# EAGLE design candle (EAGLE 8.3.1)
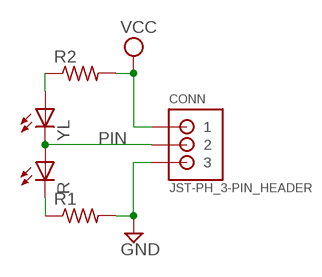
[diagram p0: schematic, sheet 1]

## Parts
CONN  JST-PH_3-PIN_HEADER  [JST_B3B-PH_HEADER]
R  LED3MM  [LED3MM]
R1  R-US_M1206  [M1206]
R2  R-US_M1206  [M1206]
YL  LED3MM  [LED3MM]

## Nets
GND: CONN.P3 R1.2
N$2: R2.1 YL.A
N$3: R1.1 R.K(C)
PIN: CONN.P2 R.A YL.K(C)
VCC: CONN.P1 R2.2

## Library data of the parts
CONN = srg:JST-PH_3-PIN_HEADER: 3-pin JST PH Shrouded Header, top entry P/N B3B-PH-K-S Mating connector PHR-3
R YL = led:LED: LED OSRAM: - CHIPLED LG R971, LG N971, LY N971, LG Q971, LY Q971, LO R971, LY R971 LH N974, LH R974 LS Q976, LO Q976, LY Q976 LO Q996 - Hyper CHIPLED LW Q18S LB Q993, LB Q99A, LB R99A - SideLED LS A670, LO A670, LY A670, LG A670, LP A670 LB A673, LV A673, LT A673, LW A673 LH A674 LY A675 LS A676, LA A676, LO A676, LY A676, LW A676 LS A679, LY A679, LG A679 - Hyper Micro SIDELED® LS Y876, LA Y876, LO Y876, LY Y876 LT Y87S - SmartLED LW L88C, LW L88S LB L89C, LB L89S, LG L890 LS L89K, LO L89K, LY L89K LS L896, LA L896, LO L896, LY L896 - TOPLED LS T670, LO T670, LY T670, LG T670, LP T670 LSG T670, LSP T670, LSY T670, LOP T670, LYG T670 LG T671, LOG T671, LSG T671 LB T673, LV T673, LT T673, LW T673 LH T674 LS T676, LA T676, LO T676, LY T676, LB T676, LH T676, LSB T676, LW T676 LB T67C, LV T67C, LT T67C, LS T67K, LO T67K, LY T67K, LW E67C LS E67B, LA E67B, LO E67B, LY E67B, LB E67C, LV E67C, LT E67C LW T67C LS T679, LY T679, LG T679 LS T770, LO T770, LY T770, LG T770, LP T770 LB T773, LV T773, LT T773, LW T773 LH T774 LS E675, LA E675, LY E675, LS T675 LS T776, LA T776, LO T776, LY T776, LB T776 LHGB T686 LT T68C, LB T68C - Hyper Mini TOPLED® LB M676 - Mini TOPLED Santana® LG M470 LS M47K, LO M47K, LY M47K Source: http://www.osram.convergy.de LUXEON: - LUMILED® LXK2-PW12-R00, LXK2-PW12-S00, LXK2-PW14-U00, LXK2-PW14-V00 LXK2-PM12-R00, LXK2-PM12-S00, LXK2-PM14-U00 LXK2-PE12-Q00, LXK2-PE12-R00, LXK2-PE12-S00, LXK2-PE14-T00, LXK2-PE14-U00 LXK2-PB12-K00, LXK2-PB12-L00, LXK2-PB12-M00, LXK2-PB14-N00, LXK2-PB14-P00, LXK2-PB14-Q00 LXK2-PR12-L00, LXK2-PR12-M00, LXK2-PR14-Q00, LXK2-PR14-R00 LXK2-PD12-Q00, LXK2-PD12-R00, LXK2-PD12-S00 LXK2-PH12-R00, LXK2-PH12-S00 LXK2-PL12-P00, LXK2-PL12-Q00, LXK2-PL12-R00 Source: www.luxeon.com KINGBRIGHT: KA-3528ASYC Source: www.kingbright.com
R1 R2 = resistor:R-US_: RESISTOR, American symbol

## Board
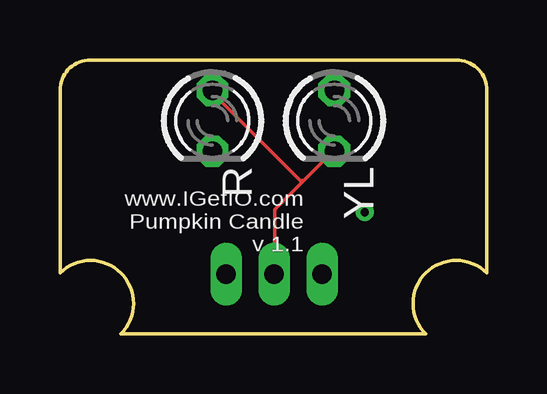
[diagram p1: board, top side]
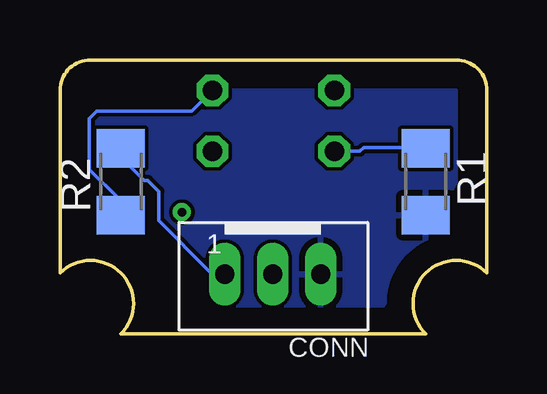
[diagram p2: board, bottom side, seen from below]

Size 17.78 x 11.43 mm. Coordinates in mm from the lower left corner, seen from the top.
Outline: 16.51,11.43 1.27,11.43 arc90 0,10.16 0,2.54 arc-180 2.54,0 15.24,0 arc-180 17.78,2.54 17.78,10.16 arc90 16.51,11.43
Copper layers (1*16): Top 0.035mm / dielectric 1.5mm / Bottom 0.035mm
Design rules "default": minimum track width 6mil, minimum drill 0.35mm, track to track 6mil, track to pad 6mil, pad to pad 6mil, via to via 6mil, smd to smd 6mil, copper to edge 40mil, drill to drill 6mil, minimum pad ring 10mil, minimum via ring 8mil, stop-mask expansion 4mil, vias tented up to drill 0mil, thermal gap 10mil

### Footprints (pad centres in the part's own frame; a part is rotated, then mirrored left to right if it is on the bottom)
JST_B3B-PH_HEADER = drill 0.8 long: P1 2.027,0.048; P2 0.028,0.048; P3 -1.972,0.048
LED3MM = drill 0.813 octagon: A -1.27,0; K 1.27,0
M1206 = smd 1.6 x 2: 1 -1.4,0; 2 1.4,0

### Placement (x,y rotation side)
CONN  8.89,2.54 180 bottom
R  6.35,8.89 270 top
R1  2.54,6.35 270 bottom
R2  15.24,6.35 90 bottom
YL  11.43,8.89 270 top

### Tracks (layer width: path | path; a pad name or v marks a point on that pad's centre or on a via)
GND
  pour Bottom: 1.27,10.16 1.27,6.35 2.54,3.81 5.08,0 12.7,0 15.24,3.81 16.51,6.35 16.51,10.16
N$1  (via drill 0.35)
  other vias: 12.7,5.08
N$2
  Bottom 0.152: YL.A 12.29,9.3 16.26,9.3 16.56,8.99 16.56,6.86 15.34,5.64 15.34,5.03 R2.1
N$3
  Bottom 0.152: R.K 5.28,7.62 5.13,7.77 2.54,7.77 R1.1
PIN
  Top 0.152: 10.16,6.4 11.38,7.62 YL.K | 10.16,6.4 8.94,5.18 8.94,2.59 CONN.P2 | 10.16,6.4 10.01,6.4 6.35,10.06 R.A
VCC
  Bottom 0.152: R2.2 15.19,7.62 15.19,7.31 14.28,6.4 14.12,6.4 13.66,5.94 13.66,4.72 11.53,2.59 10.92,2.59 CONN.P1

### Text on the board
tNames: www.IGetIO.com / Pumpkin Candle / v 1.1